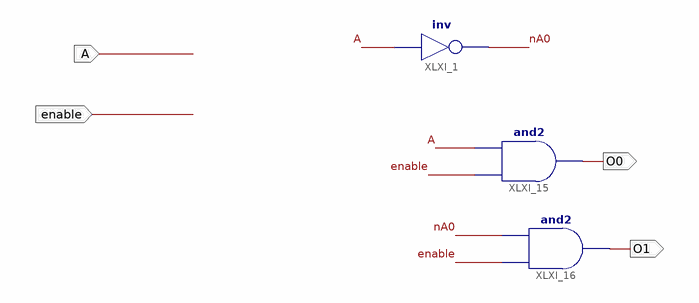
[diagram p0: schematic sheet 1]
// Xilinx ISE schematic decode1b2.sch (spartan3e) as structural Verilog: 3 symbols, 4 ports
module decode1b2 (
  input  enable,
  input  A,
  output O0,
  output O1
);

  wire nA0;

  not XLXI_1 (nA0, A);
  and XLXI_15 (O0, enable, A);
  and XLXI_16 (O1, enable, nA0);
endmodule
